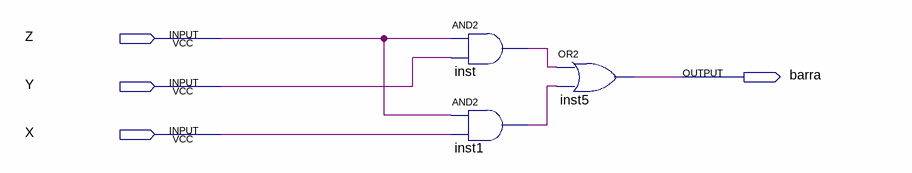
[diagram p0: schematic sheet]
// Quartus schematic barra_maior_que_dez.bdf as structural Verilog: 3 symbols, 4 pins
module barra_maior_que_dez (
  input  Z,
  input  Y,
  input  X,
  output barra
);

  wire inst1_out, inst_out;

  and inst (inst_out, Z, Y);
  and inst1 (inst1_out, Z, X);
  or inst5 (barra, inst_out, inst1_out);
endmodule
